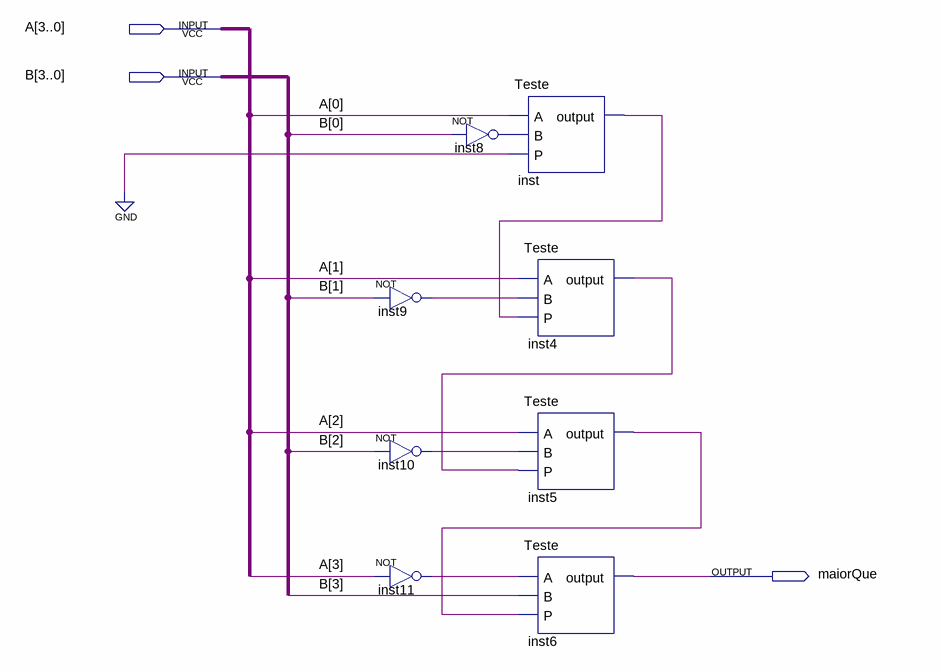
[diagram p0: schematic sheet]
// Quartus schematic maiorQue.bdf as structural Verilog: 8 symbols, 3 pins
module maiorQue (
  input  [3:0] A,
  input  [3:0] B,
  output maiorQue
);

  wire inst4_output, inst5_output, inst8_out, inst9_out, inst10_out, inst11_out, inst_output;

  not inst9 (inst9_out, B[1]);
  not inst10 (inst10_out, B[2]);
  not inst11 (inst11_out, A[3]);
  not inst8 (inst8_out, B[0]);
  Teste inst (.A(A[0]), .B(inst8_out), .P(1'b0), .\output (inst_output));
  Teste inst4 (.A(A[1]), .B(inst9_out), .P(inst_output), .\output (inst4_output));
  Teste inst5 (.A(A[2]), .B(inst10_out), .P(inst4_output), .\output (inst5_output));
  Teste inst6 (.A(inst11_out), .B(B[3]), .P(inst5_output), .\output (maiorQue));
endmodule
